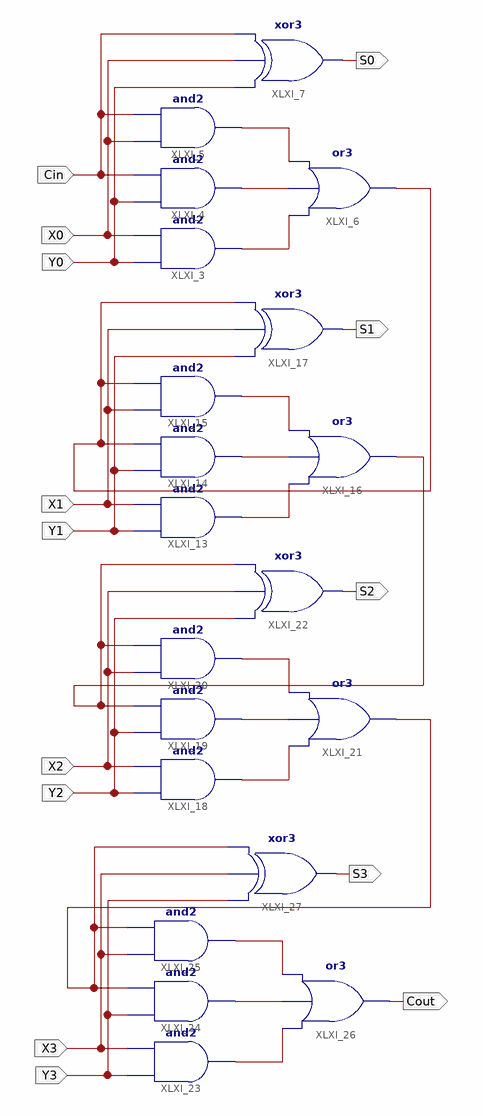
[diagram p0: schematic sheet 1]
// Xilinx ISE schematic FullAdder.sch (spartan3e) as structural Verilog: 20 symbols, 14 ports
module FullAdder (
  input  Y0,
  input  X0,
  input  Cin,
  input  Y1,
  input  X1,
  input  Y2,
  input  X2,
  input  Y3,
  input  X3,
  output S0,
  output S1,
  output S2,
  output S3,
  output Cout
);

  wire XLXN_12, XLXN_13, XLXN_14, XLXN_32, XLXN_33, XLXN_34, XLXN_41, XLXN_42, XLXN_43, XLXN_44, XLXN_51,
       XLXN_52, XLXN_53, XLXN_54, XLXN_61;

  and XLXI_3 (XLXN_14, Y0, X0);
  and XLXI_4 (XLXN_13, Y0, Cin);
  and XLXI_5 (XLXN_12, X0, Cin);
  or XLXI_6 (XLXN_41, XLXN_14, XLXN_13, XLXN_12);
  xor XLXI_7 (S0, Y0, X0, Cin);
  and XLXI_13 (XLXN_34, Y1, X1);
  and XLXI_14 (XLXN_33, Y1, XLXN_41);
  and XLXI_15 (XLXN_32, X1, XLXN_41);
  or XLXI_16 (XLXN_51, XLXN_34, XLXN_33, XLXN_32);
  xor XLXI_17 (S1, Y1, X1, XLXN_41);
  and XLXI_18 (XLXN_44, Y2, X2);
  and XLXI_19 (XLXN_43, Y2, XLXN_51);
  and XLXI_20 (XLXN_42, X2, XLXN_51);
  or XLXI_21 (XLXN_61, XLXN_44, XLXN_43, XLXN_42);
  xor XLXI_22 (S2, Y2, X2, XLXN_51);
  and XLXI_23 (XLXN_54, Y3, X3);
  and XLXI_24 (XLXN_53, Y3, XLXN_61);
  and XLXI_25 (XLXN_52, X3, XLXN_61);
  or XLXI_26 (Cout, XLXN_54, XLXN_53, XLXN_52);
  xor XLXI_27 (S3, Y3, X3, XLXN_61);
endmodule
